# Altium schematic sheet Op_Amp_Sig_Process_Off-Board_Connector_Etc.SchDoc: Off-Board Connector, Misc.
size B; SheetNumber: 5; SheetTotal: 5
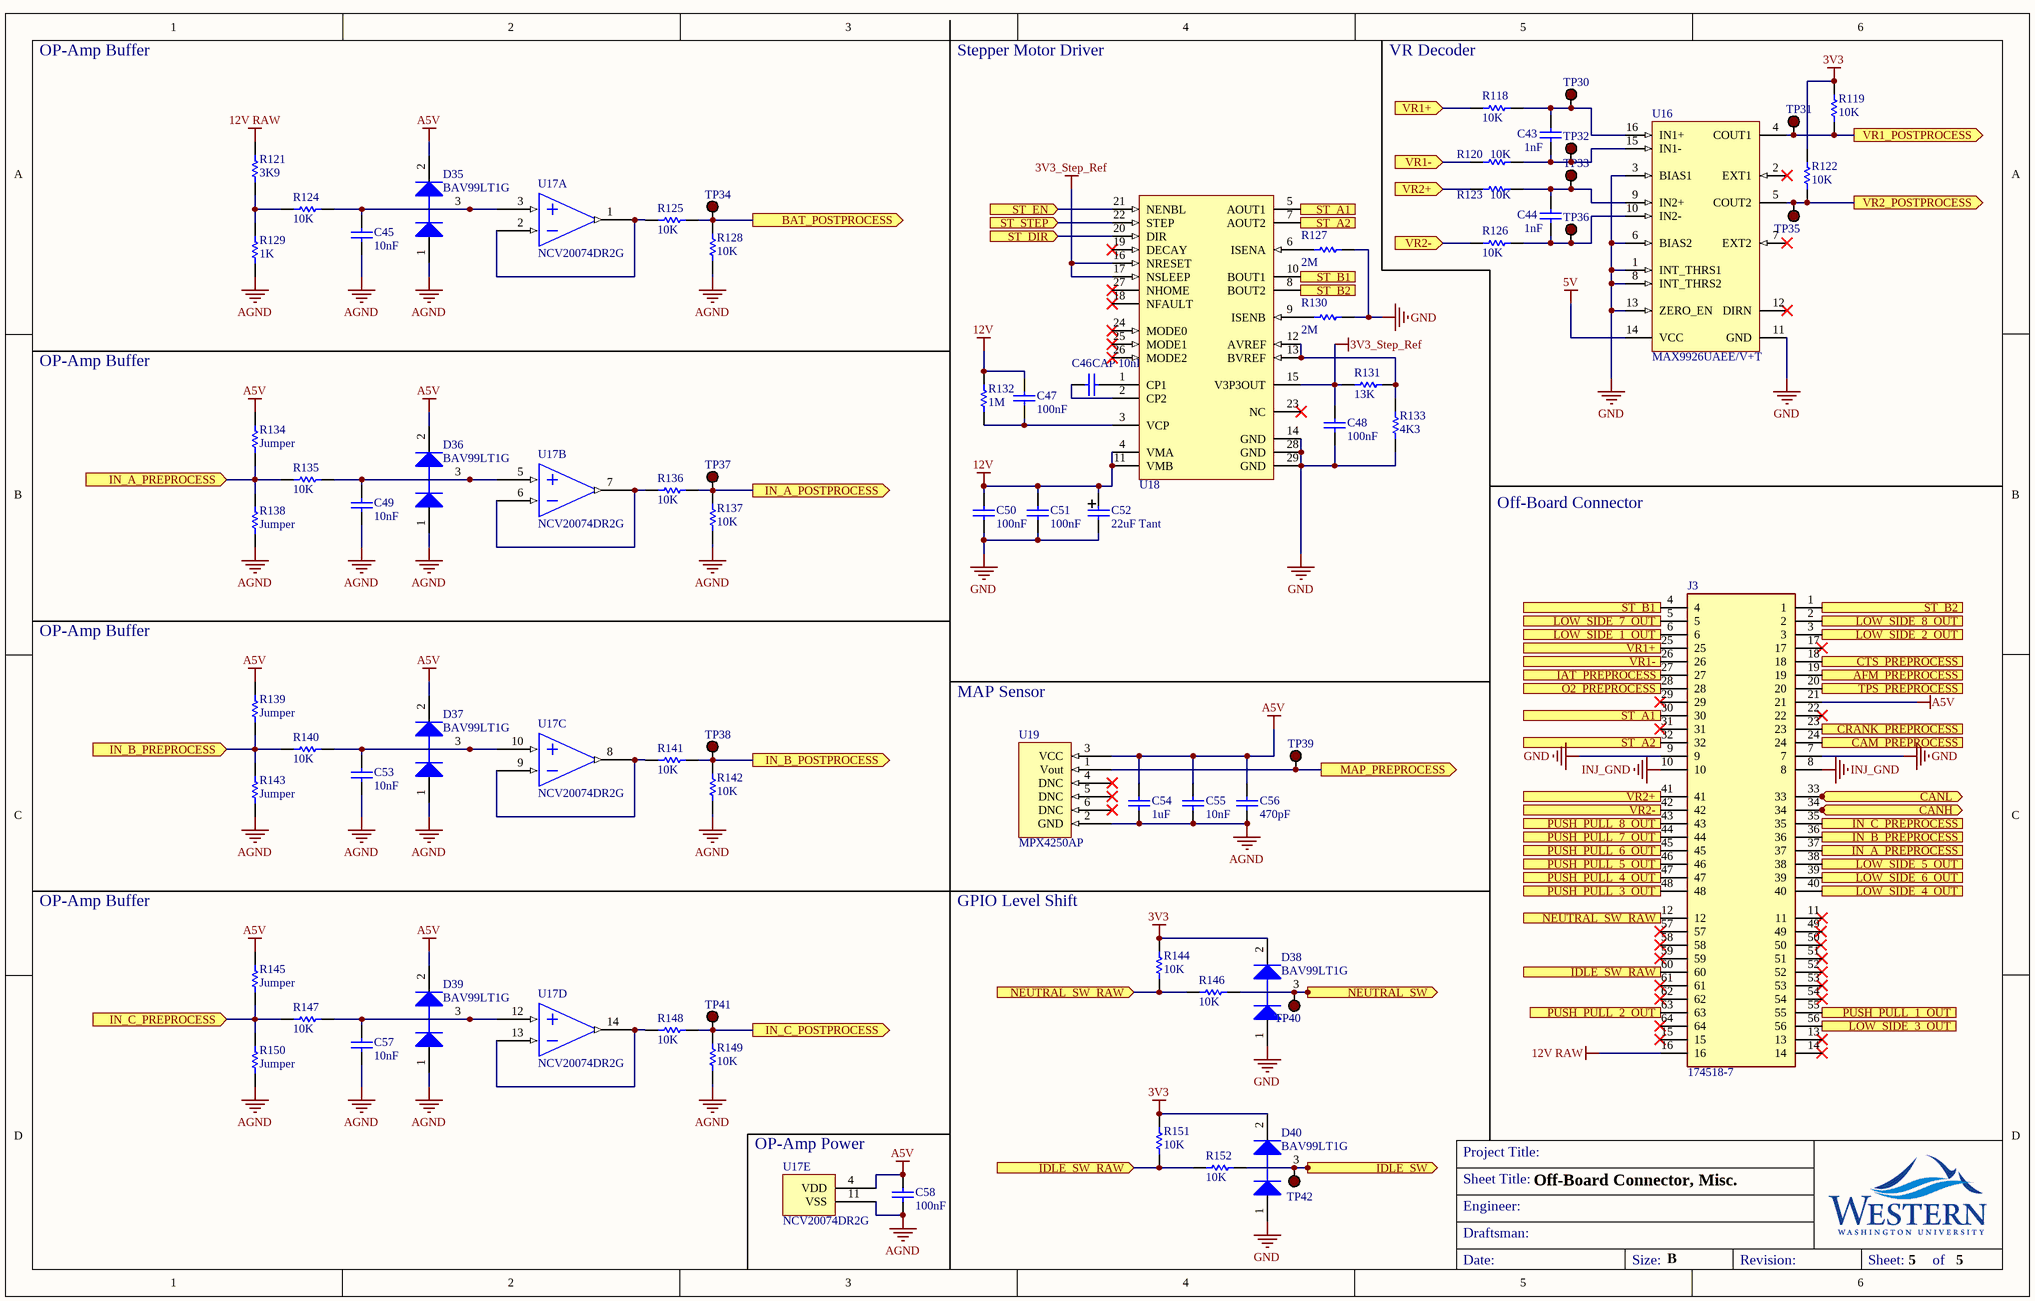
[diagram p0: Op_Amp_Sig_Process_Off-Board_Connector_Etc.SchDoc]

## Parts
C43  1nF  [CAPC0603(1608)100_M]
C44  1nF  [CAPC0603(1608)100_M]
C45  10nF  [CAPC0603(1608)100_M]
C46  CAP 10nF 50V 0603(1608)  [CAPC0603(1608)100_M]
C47  100nF  [CAPC0603(1608)100_M]
C48  100nF  [CAPC0603(1608)100_M]
C49  10nF  [CAPC0603(1608)100_M]
C50  100nF  [CAPC0603(1608)100_M]
C51  100nF  [CAPC0603(1608)100_M]
C52  22uF Tant  [CAPC1210(3225)280_M]
C53  10nF  [CAPC0603(1608)100_M]
C54  1uF  [CAPC0603(1608)100_N]
C55  10nF  [CAPC0603(1608)100_N]
C56  470pF  [CAPC0603(1608)100_N]
C57  10nF  [CAPC0603(1608)100_M]
C58  100nF  [CAPC0603(1608)100_M]
D35  BAV99LT1G  [ONSC-SOT-23-3-318-08_V]
D36  BAV99LT1G  [ONSC-SOT-23-3-318-08_V]
D37  BAV99LT1G  [ONSC-SOT-23-3-318-08_V]
D38  BAV99LT1G  [ONSC-SOT-23-3-318-08_V]
D39  BAV99LT1G  [ONSC-SOT-23-3-318-08_V]
D40  BAV99LT1G  [ONSC-SOT-23-3-318-08_V]
J3  174518-7  [174518-7]
R118  10K  [RESC0603(1608)_M]
R119  10K  [RESC0603(1608)_M]
R120  10K  [RESC0603(1608)_M]
R121  3K9  [RESC0603(1608)_M]
R122  10K  [RESC0603(1608)_M]
R123  10K  [RESC0603(1608)_M]
R124  10K  [RESC0603(1608)_M]
R125  10K  [RESC0603(1608)_M]
R126  10K  [RESC0603(1608)_M]
R127  2M  [RESC0603(1608)_M]
R128  10K  [RESC0603(1608)_M]
R129  1K  [RESC0603(1608)_M]
R130  2M  [RESC0603(1608)_M]
R131  13K  [RESC0603(1608)_M]
R132  1M  [RESC0603(1608)_M]
R133  4K3  [RESC0603(1608)_M]
R134  Jumper  [RESC0603(1608)_M]
R135  10K  [RESC0603(1608)_M]
R136  10K  [RESC0603(1608)_M]
R137  10K  [RESC0603(1608)_M]
R138  Jumper  [RESC0603(1608)_M]
R139  Jumper  [RESC0603(1608)_M]
R140  10K  [RESC0603(1608)_M]
R141  10K  [RESC0603(1608)_M]
R142  10K  [RESC0603(1608)_M]
R143  Jumper  [RESC0603(1608)_M]
R144  10K  [RESC0603(1608)_N]
R145  Jumper  [RESC0603(1608)_M]
R146  10K  [RESC0603(1608)_N]
R147  10K  [RESC0603(1608)_M]
R148  10K  [RESC0603(1608)_M]
R149  10K  [RESC0603(1608)_M]
R150  Jumper  [RESC0603(1608)_M]
R151  10K  [RESC0603(1608)_N]
R152  10K  [RESC0603(1608)_N]
TP30  5001  [Keystone_5001]  (value not drawn)
TP31  5001  [Keystone_5001]  (value not drawn)
TP32  5001  [Keystone_5001]  (value not drawn)
TP33  5001  [Keystone_5001]  (value not drawn)
TP34  5001  [Keystone_5001]  (value not drawn)
TP35  5001  [Keystone_5001]  (value not drawn)
TP36  5001  [Keystone_5001]  (value not drawn)
TP37  5001  [Keystone_5001]  (value not drawn)
TP38  5001  [Keystone_5001]  (value not drawn)
TP39  5001  [Keystone_5001]  (value not drawn)
TP40  5001  [Keystone_5001]  (value not drawn)
TP41  5001  [Keystone_5001]  (value not drawn)
TP42  5001  [Keystone_5001]  (value not drawn)
U16  MAX9926UAEE/V+T  [MAXM-E16+1_N]
U17  NCV20074DR2G  [NCV20074DR2G]  (parts A,B,C,D,E of 5)
U18  DRV8225  [DRV8825]  (value not drawn)
U19  MPX4250AP  [MPX4250AP]

## Ports
AFM_PREPROCESS (out), BAT_POSTPROCESS (out), CAM_PREPROCESS (out), CANH (bidir), CANL (bidir), CRANK_PREPROCESS (out), CTS_PREPROCESS (out), IAT_PREPROCESS (out), IDLE_SW (out), IDLE_SW_RAW (in), IDLE_SW_RAW (out), IN_A_POSTPROCESS (out), IN_A_PREPROCESS (in), IN_A_PREPROCESS (out), IN_B_POSTPROCESS (out), IN_B_PREPROCESS (in), IN_B_PREPROCESS (out), IN_C_POSTPROCESS (out), IN_C_PREPROCESS (in), IN_C_PREPROCESS (out), LOW_SIDE_1_OUT (in), LOW_SIDE_2_OUT (in), LOW_SIDE_3_OUT (in), LOW_SIDE_4_OUT (in), LOW_SIDE_5_OUT (in), LOW_SIDE_6_OUT (in), LOW_SIDE_7_OUT (in), LOW_SIDE_8_OUT (in), MAP_PREPROCESS (out), NEUTRAL_SW (out), NEUTRAL_SW_RAW (in), NEUTRAL_SW_RAW (out), O2_PREPROCESS (out), PUSH_PULL_1_OUT (in), PUSH_PULL_2_OUT (in), PUSH_PULL_3_OUT (in), PUSH_PULL_4_OUT (in), PUSH_PULL_5_OUT (in), PUSH_PULL_6_OUT (in), PUSH_PULL_7_OUT (in), PUSH_PULL_8_OUT (in), ST_A1 (in), ST_A1 (out), ST_A2 (in), ST_A2 (out), ST_B1 (in), ST_B1 (out), ST_B2 (in), ST_B2 (out), ST_DIR (in), ST_EN (in), ST_STEP (in), TPS_PREPROCESS (out), VR1+ (in), VR1+ (out), VR1- (in), VR1- (out), VR1_POSTPROCESS (out), VR2+ (in), VR2+ (out), VR2- (in), VR2- (out), VR2_POSTPROCESS (out)

## Nets
3V3: D38.2(K) D40.2(K) R119.2 R122.2 R144.2 R151.2
3V3_Step_Ref: C48.2 R131.2 U18.15(V3P3OUT) U18.16(NRESET) U18.17(NSLEEP)
5V: U16.14(VCC)
12V: C47.1 C50.2 C51.2 C52.2 R132.2 U18.4(VMA) U18.11(VMB)
12V RAW: J3.16 R121.2
A5V: C54.2 C55.2 C56.2 C58.2 D35.2(K) D36.2(K) D37.2(K) D39.2(K) J3.21 R134.2 R139.2 R145.2 U17.4(VDD) U19.3(VCC)
AGND: C45.1 C49.1 C53.1 C54.1 C55.1 C56.1 C57.1 C58.1 D35.1(A) D36.1(A) D37.1(A) D39.1(A) R128.1 R129.1 R137.1 R138.1 R142.1 R143.1 R149.1 R150.1 U17.11(VSS) U19.2(GND)
GND: C48.1 C50.1 C51.1 C52.1 D38.1(A) D40.1(A) J3.7 J3.9 R127.1 R130.1 R133.2 U16.1(INT_THRS1) U16.3(BIAS1) U16.6(BIAS2) U16.8(INT_THRS2) U16.11(GND) U16.13(ZERO_EN) U18.14(GND) U18.28(GND) U18.29(GND)
INJ_GND: J3.8 J3.10
AFM_PREPROCESS: J3.19 ; port AFM_PREPROCESS
BAT_POSTPROCESS: R125.2 R128.2 TP34.1(TP) ; port BAT_POSTPROCESS
CAM_PREPROCESS: J3.24 ; port CAM_PREPROCESS
CRANK_PREPROCESS: J3.23 ; port CRANK_PREPROCESS
CTS_PREPROCESS: J3.18 ; port CTS_PREPROCESS
IAT_PREPROCESS: J3.27 ; port IAT_PREPROCESS
IDLE_SW: D40.3(K/A) R152.1 TP42.1(TP) ; port IDLE_SW
IDLE_SW_RAW: J3.60 R151.1 R152.2 ; port IDLE_SW_RAW
IN_A_POSTPROCESS: R136.2 R137.2 TP37.1(TP) ; port IN_A_POSTPROCESS
IN_A_PREPROCESS: J3.37 R134.1 R135.1 R138.2 ; port IN_A_PREPROCESS
IN_B_POSTPROCESS: R141.2 R142.2 TP38.1(TP) ; port IN_B_POSTPROCESS
IN_B_PREPROCESS: J3.36 R139.1 R140.1 R143.2 ; port IN_B_PREPROCESS
IN_C_POSTPROCESS: R148.2 R149.2 TP41.1(TP) ; port IN_C_POSTPROCESS
IN_C_PREPROCESS: J3.35 R145.1 R147.1 R150.2 ; port IN_C_PREPROCESS
LOW_SIDE_1_OUT: J3.6 ; port LOW_SIDE_1_OUT
LOW_SIDE_2_OUT: J3.3 ; port LOW_SIDE_2_OUT
LOW_SIDE_3_OUT: J3.56 ; port LOW_SIDE_3_OUT
LOW_SIDE_4_OUT: J3.40 ; port LOW_SIDE_4_OUT
LOW_SIDE_5_OUT: J3.38 ; port LOW_SIDE_5_OUT
LOW_SIDE_6_OUT: J3.39 ; port LOW_SIDE_6_OUT
LOW_SIDE_7_OUT: J3.5 ; port LOW_SIDE_7_OUT
LOW_SIDE_8_OUT: J3.2 ; port LOW_SIDE_8_OUT
MAP_PREPROCESS: TP39.1(TP) U19.1(Vout) ; port MAP_PREPROCESS
NEUTRAL_SW: D38.3(K/A) R146.1 TP40.1(TP) ; port NEUTRAL_SW
NEUTRAL_SW_RAW: J3.12 R144.1 R146.2 ; port NEUTRAL_SW_RAW
O2_PREPROCESS: J3.28 ; port O2_PREPROCESS
PUSH_PULL_1_OUT: J3.55 ; port PUSH_PULL_1_OUT
PUSH_PULL_2_OUT: J3.63 ; port PUSH_PULL_2_OUT
PUSH_PULL_3_OUT: J3.48 ; port PUSH_PULL_3_OUT
PUSH_PULL_4_OUT: J3.47 ; port PUSH_PULL_4_OUT
PUSH_PULL_5_OUT: J3.46 ; port PUSH_PULL_5_OUT
PUSH_PULL_6_OUT: J3.45 ; port PUSH_PULL_6_OUT
PUSH_PULL_7_OUT: J3.44 ; port PUSH_PULL_7_OUT
PUSH_PULL_8_OUT: J3.43 ; port PUSH_PULL_8_OUT
ST_A1: J3.30 U18.5(AOUT1) ; port ST_A1
ST_A2: J3.32 U18.7(AOUT2) ; port ST_A2
ST_B1: J3.4 U18.10(BOUT1) ; port ST_B1
ST_B2: J3.1 U18.8(BOUT2) ; port ST_B2
ST_DIR: U18.20(DIR) ; port ST_DIR
ST_EN: U18.21(NENBL) ; port ST_EN
ST_STEP: U18.22(STEP) ; port ST_STEP
TPS_PREPROCESS: J3.20 ; port TPS_PREPROCESS
VR1+: J3.25 R118.2 ; port VR1+
VR1-: J3.26 R120.2 ; port VR1-
VR1_POSTPROCESS: R119.1 TP31.1(TP) U16.4(COUT1) ; port VR1_POSTPROCESS
VR2+: J3.41 R123.2 ; port VR2+
VR2-: J3.42 R126.2 ; port VR2-
VR2_POSTPROCESS: R122.1 TP35.1(TP) U16.5(COUT2) ; port VR2_POSTPROCESS
NetC43_1: C43.1 R118.1 TP30.1(TP) U16.16(IN1+)
NetC43_2: C43.2 R120.1 TP32.1(TP) U16.15(IN1-)
NetC44_1: C44.1 R123.1 TP33.1(TP) U16.9(IN2+)
NetC44_2: C44.2 R126.1 TP36.1(TP) U16.10(IN2-)
NetC45_2: C45.2 D35.3(K/A) R124.2 U17.3(IN1+)
NetC46_1: C46.1 U18.1(CP1)
NetC46_2: C46.2 U18.2(CP2)
NetC47_2: C47.2 R132.1 U18.3(VCP)
NetC49_2: C49.2 D36.3(K/A) R135.2 U17.5(IN2+)
NetC53_2: C53.2 D37.3(K/A) R140.2 U17.10(IN3+)
NetC57_2: C57.2 D39.3(K/A) R147.2 U17.12(IN4+)
NetR121_1: R121.1 R124.1 R129.2
NetR125_1: R125.1 U17.1(OUT1) U17.2(IN1-)
NetR127_2: R127.2 U18.6(ISENA)
NetR130_2: R130.2 U18.9(ISENB)
NetR131_1: R131.1 R133.1 U18.12(AVREF) U18.13(BVREF)
NetR136_1: R136.1 U17.6(IN2-) U17.7(OUT2)
NetR141_1: R141.1 U17.8(OUT3) U17.9(IN3-)
NetR148_1: R148.1 U17.13(IN4-) U17.14(OUT4)

Not connected (* = marked no-connect by the designer): J3 11* 13* 14* 15* 17* 22* 29* 31* 33 34 49 50 51* 52* 53* 54* 57* 58* 59* 61* 62* 64*; U16 2(EXT1)* 7(EXT2)* 12(DIRN)*; U18 18(NFAULT)* 19(DECAY)* 23(NC)* 24(MODE0)* 25(MODE1)* 26(MODE2)* 27(NHOME)*; U19 4(DNC)* 5(DNC)* 6(DNC)*

## Notes on the sheet
- OP-Amp Buffer
- Stepper Motor Driver
- (near R118) VR Decoder
- Off-Board Connector
- MAP Sensor
- GPIO Level Shift
- (near U17) OP-Amp Power
- Sheet Title:
- Project Title:
- Engineer:
- Draftsman:
- Date:
- Size:
- B
- Revision:
- Sheet:        of

## Library data of the parts
C43 C44 = CMP-1035-01887-1: CAP 1nF 50V ±2% 0603 (1608 Metric) Thickness 1mm SMD; Case-EIA: 0603; Case-Metric: 1608; Tolerance: Â±2%; Max Thickness: 1 mm; Rated Voltage: 50 V; Value: 1nF; Technology: SMT
C45 C49 C53 C57 = CMP-1035-02320-1: CAP 10nF 50V ±5% 0603 (1608 Metric) Thickness 1mm SMD; Case-EIA: 0603; Tolerance: Â±5%; Case-Metric: 1608; Value: 10nF; Max Thickness: 1 mm; Technology: SMT; Rated Voltage: 50 V
C46 = CMP-1035-02323-1: CAP 10nF 50V -20% to +80% 0603 (1608 Metric) Thickness 1mm SMD; Case-EIA: 0603; Case-Metric: 1608; Technology: SMT; Max Thickness: 1 mm; Value: 10nF; Rated Voltage: 50 V; Tolerance: -20% to +80%
C47 C48 C50 C51 C58 = CMP-1035-02580-1: CAP 100nF 10V ±10% 0603 (1608 Metric) Thickness 1mm SMD; Tolerance: Â±10%; Case-EIA: 0603; Case-Metric: 1608; Max Thickness: 1 mm; Value: 100nF; Rated Voltage: 10 V; Technology: SMT
C52 = CMP-1038-02268-1: CAP 22uF 10V ±10% 1210 (3225 Metric) Thickness 2.8mm SMD; Case-Metric: 3225; Case-EIA: 1210; Tolerance: Â±10%; Max Thickness: 2.8 mm; Value: 22uF; Technology: SMT; Rated Voltage: 10 V
C54 = CMP-1035-02745-1: CAP 1uF 50V ±10% 0603 (1608 Metric) Thickness 1mm SMD; Case-EIA: 0603; Case-Metric: 1608; Tolerance: Â±10%; Technology: SMT; Value: 1uF; Rated Voltage: 50 V; Max Thickness: 1 mm
C55 = CMP-1035-02321-1: CAP 10nF 50V ±10% 0603 (1608 Metric) Thickness 1mm SMD; Case-EIA: 0603; Case-Metric: 1608; Tolerance: Â±10%; Max Thickness: 1 mm; Rated Voltage: 50 V; Technology: SMT; Value: 10nF
C56 = CMP-1035-01673-1: CAP 470pF 50V ±1% 0603 (1608 Metric) Thickness 1mm SMD; Case-EIA: 0603; Case-Metric: 1608; Tolerance: Â±1%; Max Thickness: 1 mm; Technology: SMT; Rated Voltage: 50 V; Value: 470pF
D35-D40 = CMP-1054-00085-1: Dual Series Switching Diodes, 3-Pin SOT-23, Pb-Free, Tape and Reel; Manufacturer: On Semiconductor; trr Max (ns): 6; IF Max (A): 0.215; Configuration: Dual Series; PackageDescription: 3-Pin Small Outline Transistor, Body 2.92 x 1.3 mm, Pitch 0.95 mm; PackageVersion: Rev. AP, 11/2009; ComponentLink1Description: Manufacturer URL; RoHS: TRUE; PartNumber: BAV99LT1G; ComponentLink3URL: http://www.onsemi.cn/pub_link/Collateral/318-08.PDF; DatasheetVersion: Rev. 9; PackageReference: SOT-23-3-318-08; ComponentLink2Description: Datasheet; Packing: Tape and Reel; Mounting Technology: Surface Mount; ComponentLink1URL: http://www.onsemi.com/; ComponentLink3Description: Package Specification; ComponentLink2URL: http://www.onsemi.cn/pub_link/Collateral/BAV99LT1-D.PDF
J3 = 174518-6: Manufacturer_Name: TE Connectivity; Manufacturer_Part_Number: 176122-6; Datasheet Link: https://www.te.com/commerce/DocumentDelivery/DDEController?Action=showdoc&DocId=Customer+Drawing%7F176122%7FG4%7Fpdf%7FJapanese%7FJPN_CD_176122_G4.pdf%7F176122-6; Height: 22.2mm; Mouser Part Number: 571-176122-6; Mouser Price/Stock: https://www.mouser.com/Search/Refine.aspx?Keyword=571-176122-6
R118-R120 R122-R126 R128 R135-R137 R140-R142 R144 R146-R149 R151 R152 = CMP-1012-00623-1: 10K 0.1W 1% 0603 (1608 Metric)  SMD; Value: 10000.00 Ohm; Case-EIA: 0603; Case-Metric: 1608; Power: 0.1 W; Tolerance: 1 %; Technology: SMT
R121 = CMP-1012-00576-1: 3K9 0.1W 1% 0603 (1608 Metric)  SMD; Case-EIA: 0603; Case-Metric: 1608; Value: 3900.00 Ohm; Technology: SMT; Tolerance: 1 %; Power: 0.1 W
R127 R130 = CMP-1012-00881-1: 2M 0.1W 1% 0603 (1608 Metric)  SMD; Case-Metric: 1608; Case-EIA: 0603; Value: 2000000.00 Ohm; Tolerance: 1 %; Power: 0.1 W; Technology: SMT
R129 = CMP-1012-00510-1: 1K 0.1W 1% 0603 (1608 Metric)  SMD; Case-Metric: 1608; Case-EIA: 0603; Value: 1000.00 Ohm; Technology: SMT; Tolerance: 1 %; Power: 0.1 W
R131 = CMP-1012-00635-1: 13K 0.1W 1% 0603 (1608 Metric)  SMD; Case-EIA: 0603; Value: 13000.00 Ohm; Case-Metric: 1608; Tolerance: 1 %; Technology: SMT; Power: 0.1 W
R132 = CMP-1012-00849-1: 1M 0.1W 1% 0603 (1608 Metric)  SMD; Value: 1000000.00 Ohm; Case-EIA: 0603; Case-Metric: 1608; Power: 0.1 W; Tolerance: 1 %; Technology: SMT
R133 = CMP-1012-00581-1: 4K3 0.1W 1% 0603 (1608 Metric)  SMD; Case-Metric: 1608; Value: 4300.00 Ohm; Case-EIA: 0603; Power: 0.1 W; Tolerance: 1 %; Technology: SMT
R134 R138 R139 R143 R145 R150 = CMP-1012-00001-1: Jumper 0603 (1608 Metric); Case-Metric: 1608; Value: 0.00 Ohm; Power: None; Case-EIA: 0603; Technology: SMT; Tolerance: None
TP30-TP42 = TEST POINT: TEST POINT PC MINI .040"D BLACK; Manufacturer: Keystone Electronics; Supplier 1: Digi-Key; Manufacturer Part Number: 5001; RoHS: RoHS Compliant; Category: Test and Measurement; Stock 1: 7538; Pricing 1: 1=0.34, 10=0.315, 50=0.2296, 100=0.2206, 250=0.19812, 500=0.1891, 1000=0.15759, 2500=0.14408, 5000=0.13508 (USD); Packaging: Bulk; Type: PC Test Point, Miniature; Terminal: 0.010" x 0.020" (0.25mm x 0.51mm) Phosphor Bronze Wire, Silver Plated; Mounting Type: 0.040" (1.02mm) Hole Diameter; Material: Base, Nylon 46, UL 94V-0; Color: Black; ComponentLink1URL: http://www.keyelco.com/product-pdf.cfm?p=1310; ComponentLink1Description: http://www.keyelco.com/product-pdf.cfm?p=1310; Supplier Part Number 1: 5001K-ND
U16 = CMP-0253-00189-1: Dual-Channel, Variable Reluctance Sensor Interface with No Low Power Shutdown, 4.5 to 5.5 V, -40 to 125 degC, 16-Pin SOP (E16+1), Pb-Free, Tape and Reel; Industry Qualified: Automotive - General; Channels: 2; ComponentLink2URL: http://datasheets.maximintegrated.com/en/ds/MAX9924-MAX9927.pdf; ComponentLink2Description: Datasheet; Low Pwr. Shutdn: No; PartNumber: MAX9926UAEE/V+T; Generic Part Number: MAX9926; DatasheetVersion: Rev. 4; ComponentLink3Description: Package Specification; Code_JEDEC: MO137; ComponentLink1URL: http://www.maximintegrated.com/; Mounting Technology: Surface Mount; PackageReference: E16+1; PackageVersion: Rev. K, 04/2012; ComponentLink3URL: http://pdfserv.maximintegrated.com/package_dwgs/21-0055.PDF; ComponentLink1Description: Manufacturer URL; PackageDescription: 16-Pin Quarter Small-Outline Package (E16+1), Body 4.90 x 3.89 mm, Pitch 0.635 mm; Packing: Tape and Reel
U18 = DRV825
U19 = MPX4250